# EAGLE design avrshift (EAGLE 6.6.0)
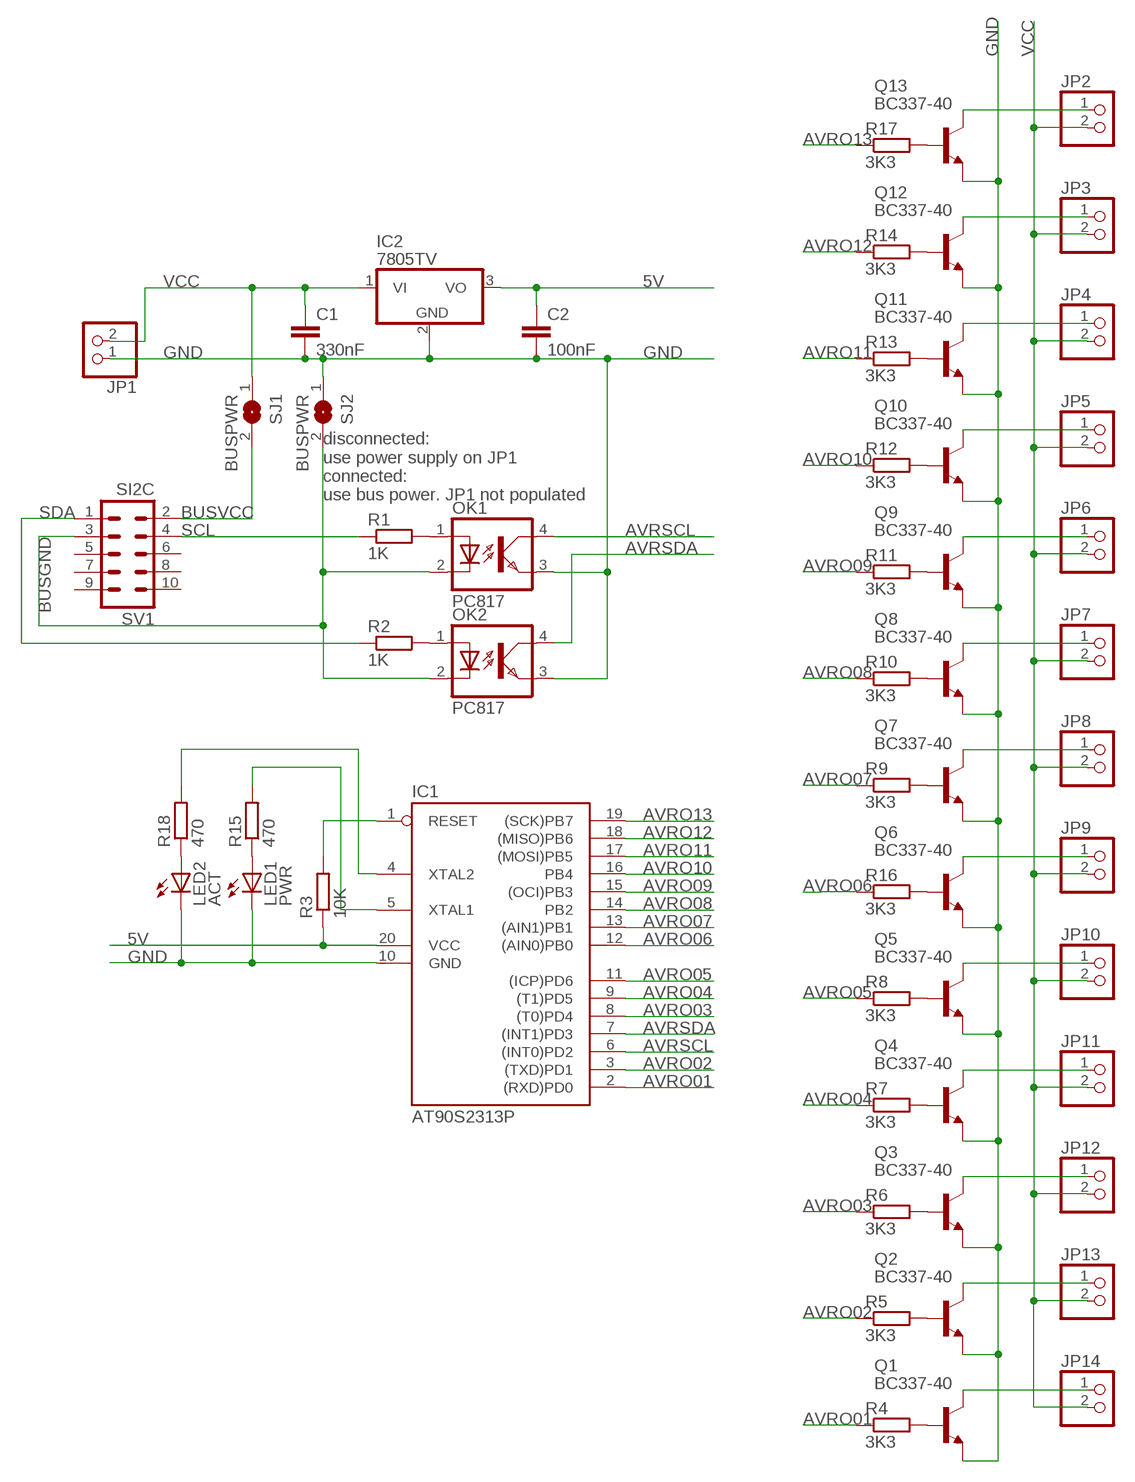
[diagram p0: schematic, sheet 1]

## Parts
C1  330nF  C2,5-3  [C2.5-3]
C2  100nF  C2,5-3  [C2.5-3]
IC1  AT90S2313P  [DIL20]
IC2  7805TV  [TO220V]
JP1  PINHD-1X2  [1X02]
JP2  PINHD-1X2  [1X02]
JP3  PINHD-1X2  [1X02]
JP4  PINHD-1X2  [1X02]
JP5  PINHD-1X2  [1X02]
JP6  PINHD-1X2  [1X02]
JP7  PINHD-1X2  [1X02]
JP8  PINHD-1X2  [1X02]
JP9  PINHD-1X2  [1X02]
JP10  PINHD-1X2  [1X02]
JP11  PINHD-1X2  [1X02]
JP12  PINHD-1X2  [1X02]
JP13  PINHD-1X2  [1X02]
JP14  PINHD-1X2  [1X02]
LED1  PWR  LED3MM  [LED3MM]
LED2  ACT  LED3MM  [LED3MM]
OK1  PC817  [DIL04]
OK2  PC817  [DIL04]
Q1  BC337-40  [TO92]
Q2  BC337-40  [TO92]
Q3  BC337-40  [TO92]
Q4  BC337-40  [TO92]
Q5  BC337-40  [TO92]
Q6  BC337-40  [TO92]
Q7  BC337-40  [TO92]
Q8  BC337-40  [TO92]
Q9  BC337-40  [TO92]
Q10  BC337-40  [TO92]
Q11  BC337-40  [TO92]
Q12  BC337-40  [TO92]
Q13  BC337-40  [TO92]
R1  1K  R-EU_0207/10  [0207/10]
R2  1K  R-EU_0207/10  [0207/10]
R3  10K  R-EU_0207/10  [0207/10]
R4  3K3  R-EU_0207/10  [0207/10]
R5  3K3  R-EU_0207/10  [0207/10]
R6  3K3  R-EU_0207/10  [0207/10]
R7  3K3  R-EU_0207/10  [0207/10]
R8  3K3  R-EU_0207/10  [0207/10]
R9  3K3  R-EU_0207/10  [0207/10]
R10  3K3  R-EU_0207/10  [0207/10]
R11  3K3  R-EU_0207/10  [0207/10]
R12  3K3  R-EU_0207/10  [0207/10]
R13  3K3  R-EU_0207/10  [0207/10]
R14  3K3  R-EU_0207/10  [0207/10]
R15  470  R-EU_0207/10  [0207/10]
R16  3K3  R-EU_0207/10  [0207/10]
R17  3K3  R-EU_0207/10  [0207/10]
R18  470  R-EU_0207/10  [0207/10]
SJ1  BUSPWR  SJ  [SJ]
SJ2  BUSPWR  SJ  [SJ]
SV1  SI2C  ML10  [ML10]

## Nets
5V: C2.1 IC1.20(VCC) IC2.3(VO) R3.1
AVRO01: IC1.2((RXD)PD0) R4.1
AVRO02: IC1.3((TXD)PD1) R5.1
AVRO03: IC1.8((T0)PD4) R6.1
AVRO04: IC1.9((T1)PD5) R7.1
AVRO05: IC1.11((ICP)PD6) R8.1
AVRO06: IC1.12((AIN0)PB0) R16.1
AVRO07: IC1.13((AIN1)PB1) R9.1
AVRO08: IC1.14(PB2) R10.1
AVRO09: IC1.15((OCI)PB3) R11.1
AVRO10: IC1.16(PB4) R12.1
AVRO11: IC1.17((MOSI)PB5) R13.1
AVRO12: IC1.18((MISO)PB6) R14.1
AVRO13: IC1.19((SCK)PB7) R17.1
AVRSCL: IC1.6((INT0)PD2) OK1.4(COL)
AVRSDA: IC1.7((INT1)PD3) OK2.4(COL)
BUSGND: OK1.2(C) OK2.2(C) SJ2.2 SV1.3
BUSVCC: SJ1.2 SV1.2
GND: C1.2 C2.2 IC1.10(GND) IC2.2(GND) JP1.1 LED1.K(C) LED2.K(C) OK1.3(EMIT) OK2.3(EMIT) Q1.1(E) Q2.1(E) Q3.1(E) Q4.1(E) Q5.1(E) Q6.1(E) Q7.1(E) Q8.1(E) Q9.1(E) Q10.1(E) Q11.1(E) Q12.1(E) Q13.1(E) SJ2.1
N$1: OK1.1(A) R1.2
N$3: IC1.1(RESET) R3.2
N$4: OK2.1(A) R2.2
N$5: Q13.2(B) R17.2
N$6: JP13.1 Q2.3(C)
N$7: JP2.1 Q13.3(C)
N$8: LED2.A R18.1
N$9: Q1.2(B) R4.2
N$10: LED1.A R15.1
N$11: Q2.2(B) R5.2
N$12: Q3.2(B) R6.2
N$13: Q4.2(B) R7.2
N$14: Q5.2(B) R8.2
N$15: Q7.2(B) R9.2
N$16: Q8.2(B) R10.2
N$17: Q9.2(B) R11.2
N$18: Q10.2(B) R12.2
N$19: Q11.2(B) R13.2
N$20: Q12.2(B) R14.2
N$21: IC1.4(XTAL2) R18.2
N$22: Q6.2(B) R16.2
N$23: JP3.1 Q12.3(C)
N$33: IC1.5(XTAL1) R15.2
N$37: JP14.1 Q1.3(C)
N$39: JP12.1 Q3.3(C)
N$40: JP11.1 Q4.3(C)
N$41: JP10.1 Q5.3(C)
N$42: JP9.1 Q6.3(C)
N$43: JP8.1 Q7.3(C)
N$44: JP7.1 Q8.3(C)
N$45: JP6.1 Q9.3(C)
N$46: JP5.1 Q10.3(C)
N$47: JP4.1 Q11.3(C)
SCL: R1.1 SV1.4
SDA: R2.1 SV1.1
VCC: C1.1 IC2.1(VI) JP1.2 JP2.2 JP3.2 JP4.2 JP5.2 JP6.2 JP7.2 JP8.2 JP9.2 JP10.2 JP11.2 JP12.2 JP13.2 JP14.2 SJ1.1
Unconnected: SV1.5 SV1.6 SV1.7 SV1.8 SV1.9 SV1.10

## Notes on the sheet
- disconnected:
  use power supply on JP1
  connected:
  use bus power. JP1 not populated

## Library data of the parts
C1 C2 = capacitor-wima:C: CAPACITOR naming: grid - package width
IC1 = atmel:AT90S2313: MICROCONTROLLER 2 Kbytes FLASH 128 bytes SRAM 128 bytes EEPROM UART; OC_FARNELL: unknown; OC_NEWARK: unknown
IC2 = linear:78*: Positive VOLTAGE REGULATOR Source: http://cache.national.com/ds/LM/LM78L05.pdf http://www.fairchildsemi.com/ds/LM/LM7805.pdf
JP1-JP14 = pinhead:PINHD-1X2: PIN HEADER
LED1 LED2 = led:LED: LED OSRAM: - CHIPLED LG R971, LG N971, LY N971, LG Q971, LY Q971, LO R971, LY R971 LH N974, LH R974 LS Q976, LO Q976, LY Q976 LO Q996 - Hyper CHIPLED LW Q18S LB Q993, LB Q99A, LB R99A - SideLED LS A670, LO A670, LY A670, LG A670, LP A670 LB A673, LV A673, LT A673, LW A673 LH A674 LY A675 LS A676, LA A676, LO A676, LY A676, LW A676 LS A679, LY A679, LG A679 - Hyper Micro SIDELED® LS Y876, LA Y876, LO Y876, LY Y876 LT Y87S - SmartLED LW L88C, LW L88S LB L89C, LB L89S, LG L890 LS L89K, LO L89K, LY L89K LS L896, LA L896, LO L896, LY L896 - TOPLED LS T670, LO T670, LY T670, LG T670, LP T670 LSG T670, LSP T670, LSY T670, LOP T670, LYG T670 LG T671, LOG T671, LSG T671 LB T673, LV T673, LT T673, LW T673 LH T674 LS T676, LA T676, LO T676, LY T676, LB T676, LH T676, LSB T676, LW T676 LB T67C, LV T67C, LT T67C, LS T67K, LO T67K, LY T67K, LW E67C LS E67B, LA E67B, LO E67B, LY E67B, LB E67C, LV E67C, LT E67C LW T67C LS T679, LY T679, LG T679 LS T770, LO T770, LY T770, LG T770, LP T770 LB T773, LV T773, LT T773, LW T773 LH T774 LS E675, LA E675, LY E675, LS T675 LS T776, LA T776, LO T776, LY T776, LB T776 LHGB T686 LT T68C, LB T68C - Hyper Mini TOPLED® LB M676 - Mini TOPLED Santana® LG M470 LS M47K, LO M47K, LY M47K Source: http://www.osram.convergy.de LUXEON: - LUMILED® LXK2-PW12-R00, LXK2-PW12-S00, LXK2-PW14-U00, LXK2-PW14-V00 LXK2-PM12-R00, LXK2-PM12-S00, LXK2-PM14-U00 LXK2-PE12-Q00, LXK2-PE12-R00, LXK2-PE12-S00, LXK2-PE14-T00, LXK2-PE14-U00 LXK2-PB12-K00, LXK2-PB12-L00, LXK2-PB12-M00, LXK2-PB14-N00, LXK2-PB14-P00, LXK2-PB14-Q00 LXK2-PR12-L00, LXK2-PR12-M00, LXK2-PR14-Q00, LXK2-PR14-R00 LXK2-PD12-Q00, LXK2-PD12-R00, LXK2-PD12-S00 LXK2-PH12-R00, LXK2-PH12-S00 LXK2-PL12-P00, LXK2-PL12-Q00, LXK2-PL12-R00 Source: www.luxeon.com KINGBRIGHT: KA-3528ASYC Source: www.kingbright.com
OK1 OK2 = optocoupler:PC817: SHARP OPTO COUPLER; MPN: PC817X4J000F; OC_FARNELL: 9707727; OC_NEWARK: 97K7059
Q1-Q13 = transistor-npn:BC337*: NPN Transistor
R1-R18 = resistor:R-EU_: RESISTOR, European symbol
SJ1 SJ2 = jumper:SJ: SMD solder JUMPER
SV1 = con-harting-ml:ML10: HARTING; OC_FARNELL: unknown; OC_NEWARK: unknown

## Board
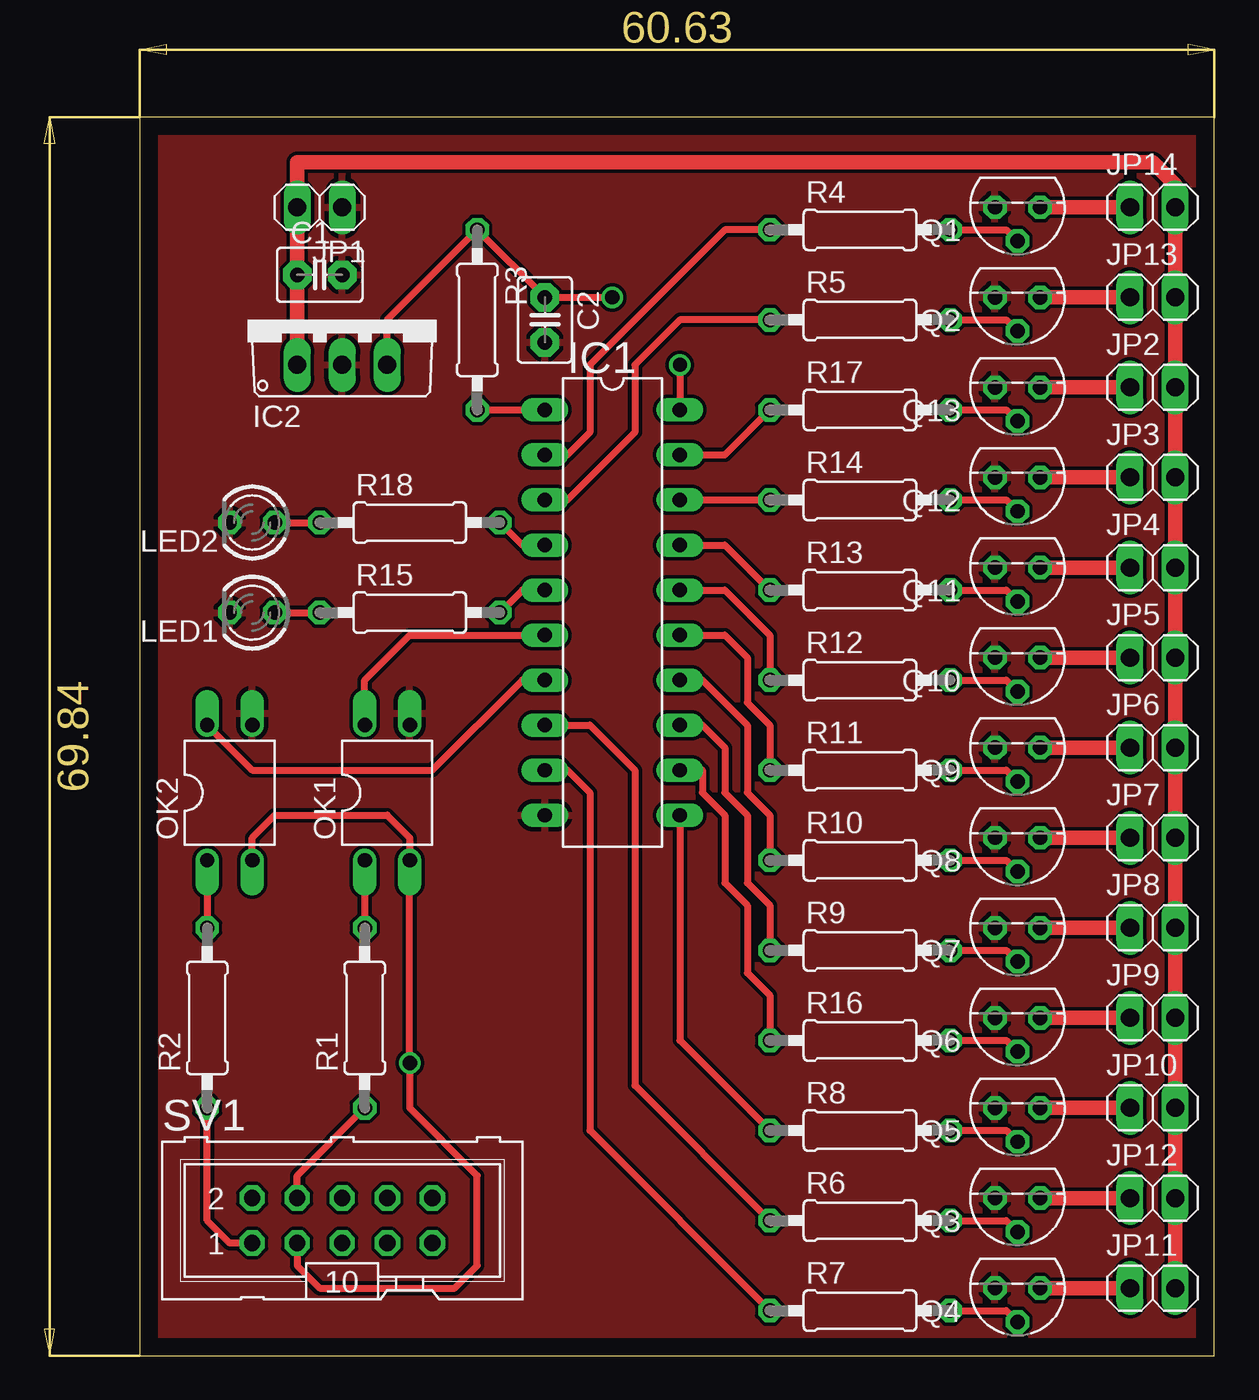
[diagram p1: board, top side]
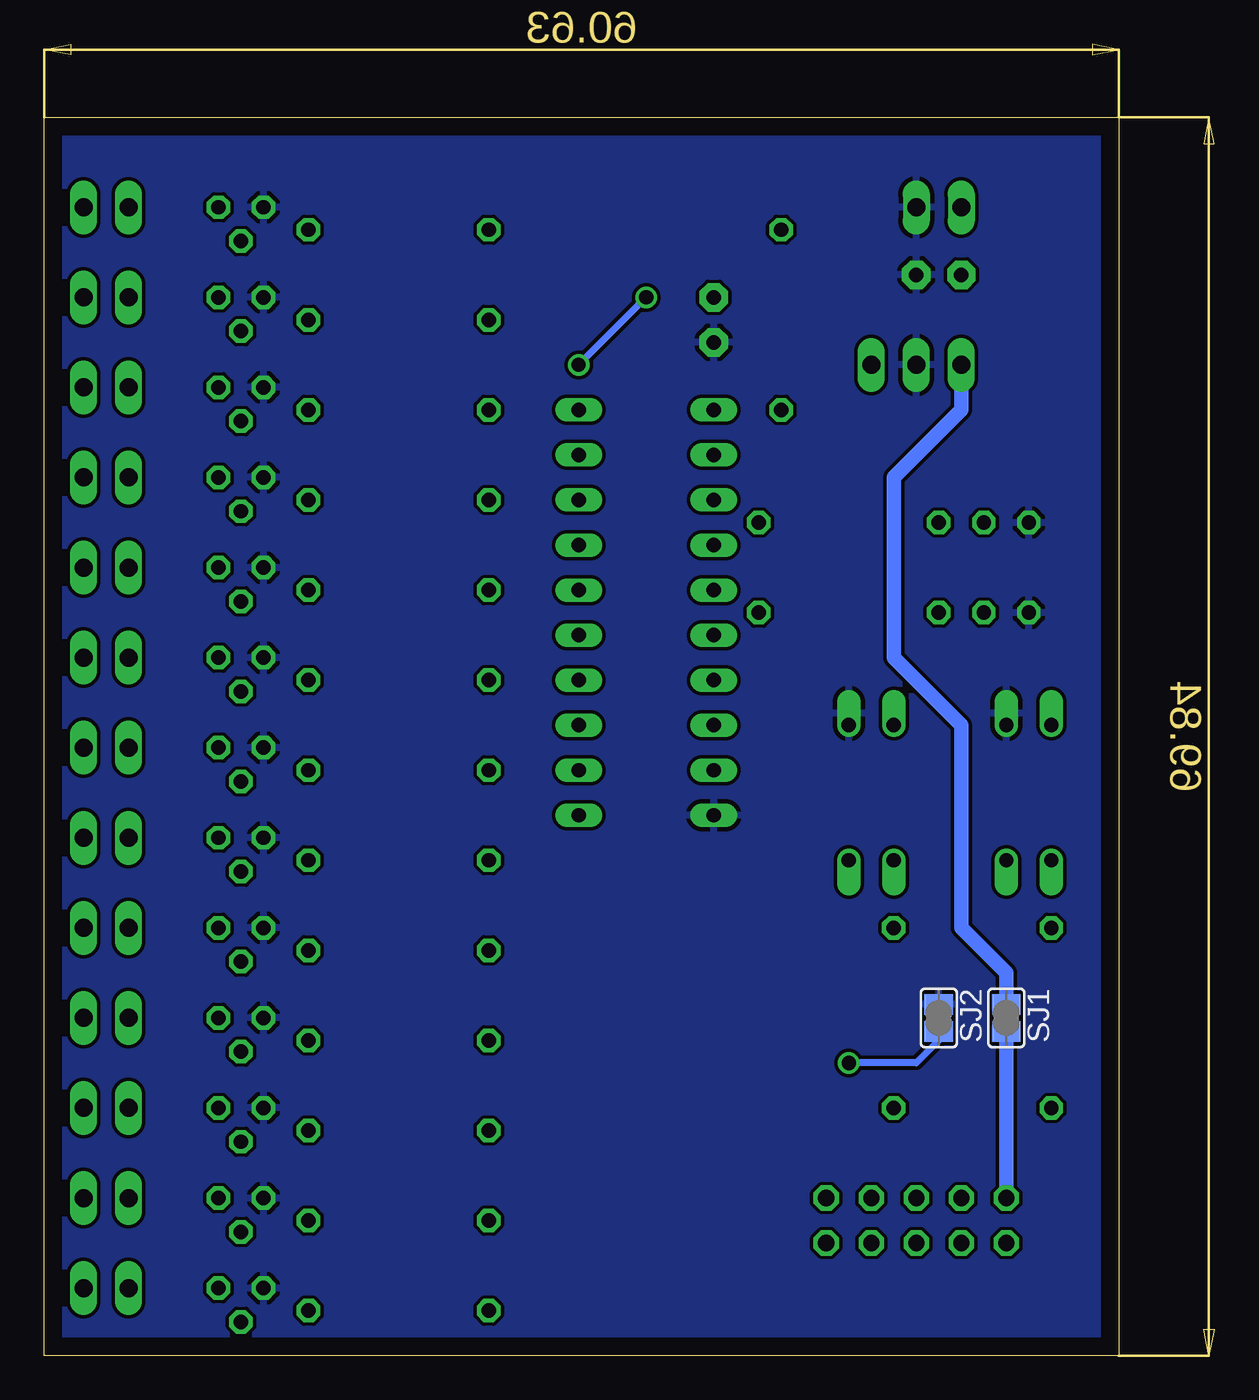
[diagram p2: board, bottom side, seen from below]

Size 60.63 x 69.84 mm. Coordinates in mm from the lower left corner, seen from the top.
Outline: 0,0 60.63,0 60.63,69.84 0,69.84 0,0
Copper layers (1*16): Top 0.035mm / dielectric 1.5mm / Bottom 0.035mm
Design rules "default": minimum track width 10mil, minimum drill 24mil, track to track 8mil, track to pad 8mil, pad to pad 8mil, via to via 8mil, smd to smd 8mil, copper to edge 40mil, drill to drill 8mil, minimum pad ring 10mil, minimum via ring 8mil, stop-mask expansion 4mil, vias tented up to drill 0mil, thermal gap 10mil

### Footprints (pad centres in the part's own frame; a part is rotated, then mirrored left to right if it is on the bottom)
C2.5-3 = drill 0.813 pad 1.6 octagon: 1 -1.27,0; 2 1.27,0
DIL20 = drill 0.813 long: 1 -11.43,-3.81; 2 -8.89,-3.81; 3 -6.35,-3.81; 4 -3.81,-3.81; 5 -1.27,-3.81; 6 1.27,-3.81; 7 3.81,-3.81; 8 6.35,-3.81; 9 8.89,-3.81; 10 11.43,-3.81; 11 11.43,3.81; 12 8.89,3.81; 13 6.35,3.81; 14 3.81,3.81; 15 1.27,3.81; 16 -1.27,3.81; 17 -3.81,3.81; 18 -6.35,3.81; 19 -8.89,3.81; 20 -11.43,3.81
TO220V = drill 1.016 long: 1 -2.54,-2.54; 2 0,-2.54; 3 2.54,-2.54
1X02 = drill 1.016 long: 1 -1.27,0; 2 1.27,0
LED3MM = drill 0.813 octagon: A -1.27,0; K 1.27,0
DIL04 = drill 0.813 offset: 1 -1.27,-3.81; 2 1.27,-3.81; 3 1.27,3.81; 4 -1.27,3.81
TO92 = drill 0.813 octagon: 1 1.27,0; 2 0,1.905; 3 -1.27,0
0207/10 = drill 0.813 octagon: 1 -5.08,0; 2 5.08,0
SJ = smd 1.168 x 1.6: 1 -0.762,0; 2 0.762,0
ML10 = drill 0.914 octagon: 1 -5.08,-1.27; 2 -5.08,1.27; 3 -2.54,-1.27; 4 -2.54,1.27; 5 0,-1.27; 6 0,1.27; 7 2.54,-1.27; 8 2.54,1.27; 9 5.08,-1.27; 10 5.08,1.27

### Placement (x,y rotation side)
C1  10.16,60.96 0 top
C2  22.86,58.42 270 top
IC1  26.67,41.91 270 top
IC2  11.43,58.42 0 top
JP1  10.16,64.77 180 top
JP2  57.15,54.61 0 top
JP3  57.15,49.53 0 top
JP4  57.15,44.45 0 top
JP5  57.15,39.37 0 top
JP6  57.15,34.29 0 top
JP7  57.15,29.21 0 top
JP8  57.15,24.13 0 top
JP9  57.15,19.05 0 top
JP10  57.15,13.97 0 top
JP11  57.15,3.81 0 top
JP12  57.15,8.89 0 top
JP13  57.15,59.69 0 top
JP14  57.15,64.77 0 top
LED1  6.35,41.91 180 top
LED2  6.35,46.99 180 top
OK1  13.97,31.75 0 top
OK2  5.08,31.75 0 top
Q1  49.53,64.77 180 top
Q2  49.53,59.69 180 top
Q3  49.53,8.89 180 top
Q4  49.53,3.81 180 top
Q5  49.53,13.97 180 top
Q6  49.53,19.05 180 top
Q7  49.53,24.13 180 top
Q8  49.53,29.21 180 top
Q9  49.53,34.29 180 top
Q10  49.53,39.37 180 top
Q11  49.53,44.45 180 top
Q12  49.53,49.53 180 top
Q13  49.53,54.61 180 top
R1  12.7,19.05 90 top
R2  3.81,19.05 90 top
R3  19.05,58.42 270 top
R4  40.64,63.5 0 top
R5  40.64,58.42 0 top
R6  40.64,7.62 0 top
R7  40.64,2.54 0 top
R8  40.64,12.7 0 top
R9  40.64,22.86 0 top
R10  40.64,27.94 0 top
R11  40.64,33.02 0 top
R12  40.64,38.1 0 top
R13  40.64,43.18 0 top
R14  40.64,48.26 0 top
R15  15.24,41.91 0 top
R16  40.64,17.78 0 top
R17  40.64,53.34 0 top
R18  15.24,46.99 0 top
SJ1  6.35,19.05 270 bottom
SJ2  10.16,19.05 270 bottom
SV1  11.43,7.62 0 top

### Tracks (layer width: path | path; a pad name or v marks a point on that pad's centre or on a via)
5V  (via drill 0.8)
  Top 0.406: IC2.3 13.97,58.42 R3.1 C2.1 v26.67,59.69 | v30.48,55.88 IC1.20
  Bottom 0.406: v26.67,59.69 v30.48,55.88
AVRO01
  Top 0.406: R4.1 33.02,63.5 25.4,55.88 25.4,52.07 24.13,50.8 IC1.2
AVRO02
  Top 0.406: R5.1 30.48,58.42 27.94,55.88 27.94,52.07 24.13,48.26 IC1.3
AVRO03
  Top 0.406: IC1.8 25.4,35.56 27.94,33.02 27.94,15.24 R6.1
AVRO04
  Top 0.406: IC1.9 24.13,33.02 25.4,31.75 25.4,12.7 R7.1
AVRO05
  Top 0.406: IC1.11 30.48,17.78 R8.1
AVRO06
  Top 0.406: IC1.12 31.75,33.02 31.75,31.75 33.02,30.48 33.02,26.67 34.29,25.4 34.29,21.59 35.56,20.32 R16.1
AVRO07
  Top 0.406: IC1.13 31.75,35.56 33.02,34.29 33.02,31.75 34.29,30.48 34.29,26.67 35.56,25.4 R9.1
AVRO08
  Top 0.406: IC1.14 31.75,38.1 34.29,35.56 34.29,31.75 35.56,30.48 R10.1
AVRO09
  Top 0.406: IC1.15 33.02,40.64 34.29,39.37 34.29,36.83 35.56,35.56 R11.1
AVRO10
  Top 0.406: IC1.16 33.02,43.18 35.56,40.64 R12.1
AVRO11
  Top 0.406: IC1.17 33.02,45.72 R13.1
AVRO12
  Top 0.406: IC1.18 R14.1
AVRO13
  Top 0.406: IC1.19 33.02,50.8 R17.1
AVRSCL
  Top 0.406: OK1.4 12.7,38.1 15.24,40.64 IC1.6
AVRSDA
  Top 0.406: OK2.4 6.35,33.02 16.51,33.02 21.59,38.1 IC1.7
BUSGND  (via drill 0.8)
  Top 0.406: SV1.3 8.89,5.08 10.16,3.81 17.78,3.81 19.05,5.08 19.05,10.16 15.24,13.97 v15.24,16.51 OK1.2 15.24,29.21 13.97,30.48 7.62,30.48 6.35,29.21 OK2.2 6.35,26.67
  Bottom 0.406: SJ2.2 10.16,17.78 11.43,16.51 v15.24,16.51
BUSVCC
  Bottom 0.813: SV1.2 SJ1.2
GND
  pour Top: 0,69.85 60.96,69.85 60.96,0 0,0
  pour Bottom: 0,0 0,69.85 60.96,69.85 60.96,0
N$1
  Top 0.406: OK1.1 R1.2
N$3
  Top 0.406: R3.2 IC1.1
N$4
  Top 0.406: OK2.1 R2.2
N$5
  Top 0.406: R17.2 48.9,53.34 Q13.2
N$6
  Top 0.813: JP13.1 Q2.3
N$7
  Top 0.813: Q13.3 JP2.1
N$8
  Top 0.406: LED2.A R18.1
N$9
  Top 0.406: R4.2 48.9,63.5 Q1.2
N$10
  Top 0.406: LED1.A R15.1
N$11
  Top 0.406: R5.2 48.9,58.42 Q2.2
N$12
  Top 0.406: R6.2 48.9,7.62 Q3.2
N$13
  Top 0.406: R7.2 48.9,2.54 Q4.2
N$14
  Top 0.406: R8.2 48.9,12.7 Q5.2
N$15
  Top 0.406: R9.2 48.9,22.86 Q7.2
N$16
  Top 0.406: R10.2 48.9,27.94 Q8.2
N$17
  Top 0.406: R11.2 48.9,33.02 Q9.2
N$18
  Top 0.406: R12.2 48.9,38.1 Q10.2
N$19
  Top 0.406: R13.2 48.9,43.18 Q11.2
N$20
  Top 0.406: R14.2 48.9,48.26 Q12.2
N$21
  Top 0.406: R18.2 21.59,45.72 IC1.4
N$22
  Top 0.406: R16.2 48.9,17.78 Q6.2
N$23
  Top 0.813: Q12.3 JP3.1
N$33
  Top 0.406: R15.2 21.59,43.18 IC1.5
N$37
  Top 0.813: JP14.1 Q1.3
N$39
  Top 0.813: JP12.1 Q3.3
N$40
  Top 0.813: JP11.1 Q4.3
N$41
  Top 0.813: Q5.3 JP10.1
N$42
  Top 0.813: Q6.3 JP9.1
N$43
  Top 0.813: Q7.3 JP8.1
N$44
  Top 0.813: Q8.3 JP7.1
N$45
  Top 0.813: Q9.3 JP6.1
N$46
  Top 0.813: Q10.3 JP5.1
N$47
  Top 0.813: Q11.3 JP4.1
SCL
  Top 0.406: SV1.4 8.89,10.16 R1.1
SDA
  Top 0.406: SV1.1 5.08,6.35 3.81,7.62 R2.1
VCC
  Top 0.813: JP13.2 58.42,60.96 | JP13.2 JP14.2 58.42,66.04 57.15,67.31 8.89,67.31 JP1.2 C1.1 IC2.1 | JP13.2 JP2.2 JP3.2 JP4.2 JP5.2 JP6.2 JP7.2 JP8.2 JP9.2 JP10.2 JP12.2 JP11.2
  Bottom 0.813: IC2.1 8.89,53.34 12.7,49.53 12.7,39.37 8.89,35.56 8.89,24.13 6.35,21.59 SJ1.1